# Altium schematic sheet temperature.SchDoc
size A
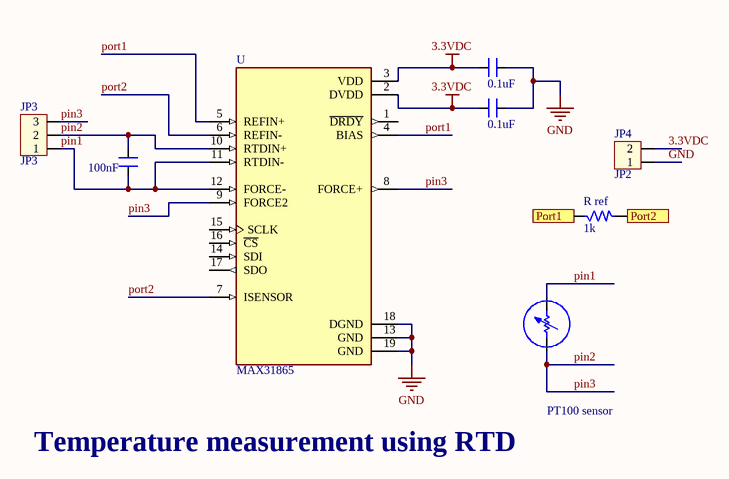
[diagram p0: temperature.SchDoc]

## Parts
(Parts that share a designator on the sheet are numbered #1, #2 ... from top to bottom, then left to right.)
?#1  0.1uF  [SM-0805]
?#2  0.1uF  [SM-0805]
?#3  100nF  [SM-0805]
?#4  (no value)  [AXIAL-0.7]
JP3  JP3  [CON3]
JP4  JP2  [CON2]
R_ref  1k  [SM-RES-1206]
U  MAX31865  [SOP65P777X199-20N]

## Ports
Port1, Port2

## Nets
3.3VDC: ?#1.1 ?#2.1 JP4.2 U.2(DVDD) U.3(VDD)
GND: ?#1.2 ?#2.2 JP4.1 U.13(GND) U.18(DGND) U.19(GND)
pin1: ?#3.1 ?#4.2 JP3.1 U.11(RTDIN-) U.12(FORCE-)
pin2: ?#3.2 ?#4.1 JP3.2 JP3.3 U.8(FORCE+) U.9(FORCE2) U.10(RTDIN+)  [also labelled pin3]
port1: U.4(BIAS) U.5(REFIN+)
Port1: R_ref.1 ; port Port1  [a separate net that carries the same name]
port2: U.6(REFIN-) U.7(ISENSOR)
Port2: R_ref.2 ; port Port2  [a separate net that carries the same name]

Not connected (* = marked no-connect by the designer): U 1(~{DRDY}) 14(SDI) 15(SCLK) 16(~{CS}) 17(SDO)

## Notes on the sheet
- PT100 sensor
- Temperature measurement using RTD

## Library data of the parts
?#1-?#3 = CM: Cap SMD; Value: 103
?#4 = Res Adj1: Variable Resistor; Set Position: 0.5; Published: 8-Jun-2000; LatestRevisionDate: 17-Jul-2002; LatestRevisionNote: Re-released for DXP Platform.; PackageReference: AXIAL-0.7; Publisher: Altium Limited; PackageDescription: Axial Device, Thru-Hole; 2 Leads; 0.7 in Pin Spacing
JP3 = Con3: Connector 3; Value: Connector 3
JP4 = Con2: Connector 2; Value: Connector 2
R_ref = R: Resistor 1/4W; Value: R1/4W - 1K
U = MAX31865AAP+: Temp Monitoring System _Sensor_ External Sensor SPI Output 20-SSOP; MF: Maxim Integrated; Price: None; Value: *; MP: MAX31865AAP+; Package: SSOP-20 Maxim; SnapEDA_Link: https://www.snapeda.com/parts/MAX31865AAP%2B/Maxim%20Integrated/view-part/215216/?ref=snap; Availability: Unavailable